# Altium schematic sheet main.SchDoc
size A4
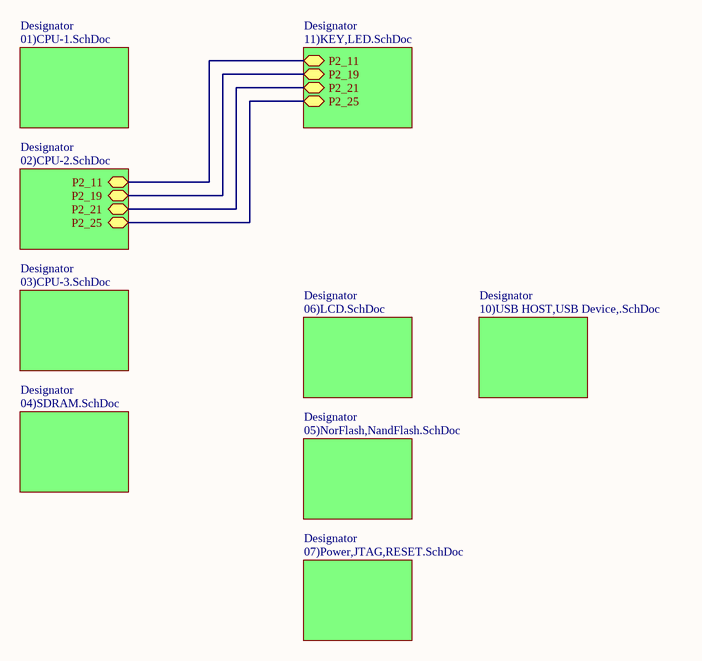
[diagram p0: main.SchDoc]

## Sub-sheets
Designator = 01)CPU-1.SchDoc: no entries
Designator = 02)CPU-2.SchDoc: P2_11, P2_19, P2_21, P2_25
Designator = 03)CPU-3.SchDoc: no entries
Designator = 04)SDRAM.SchDoc: no entries
Designator = 11)KEY,LED.SchDoc: P2_11, P2_19, P2_21, P2_25
Designator = 06)LCD.SchDoc: no entries
Designator = 05)NorFlash,NandFlash.SchDoc: no entries
Designator = 07)Power,JTAG,RESET.SchDoc: no entries
Designator = 10)USB HOST,USB Device,.SchDoc: no entries

## Nets
(unnamed): sheet Designator/P2_11, sheet Designator/P2_11
(unnamed): sheet Designator/P2_19, sheet Designator/P2_19
(unnamed): sheet Designator/P2_21, sheet Designator/P2_21
(unnamed): sheet Designator/P2_25, sheet Designator/P2_25